# Altium project Navigation.PrjPCB
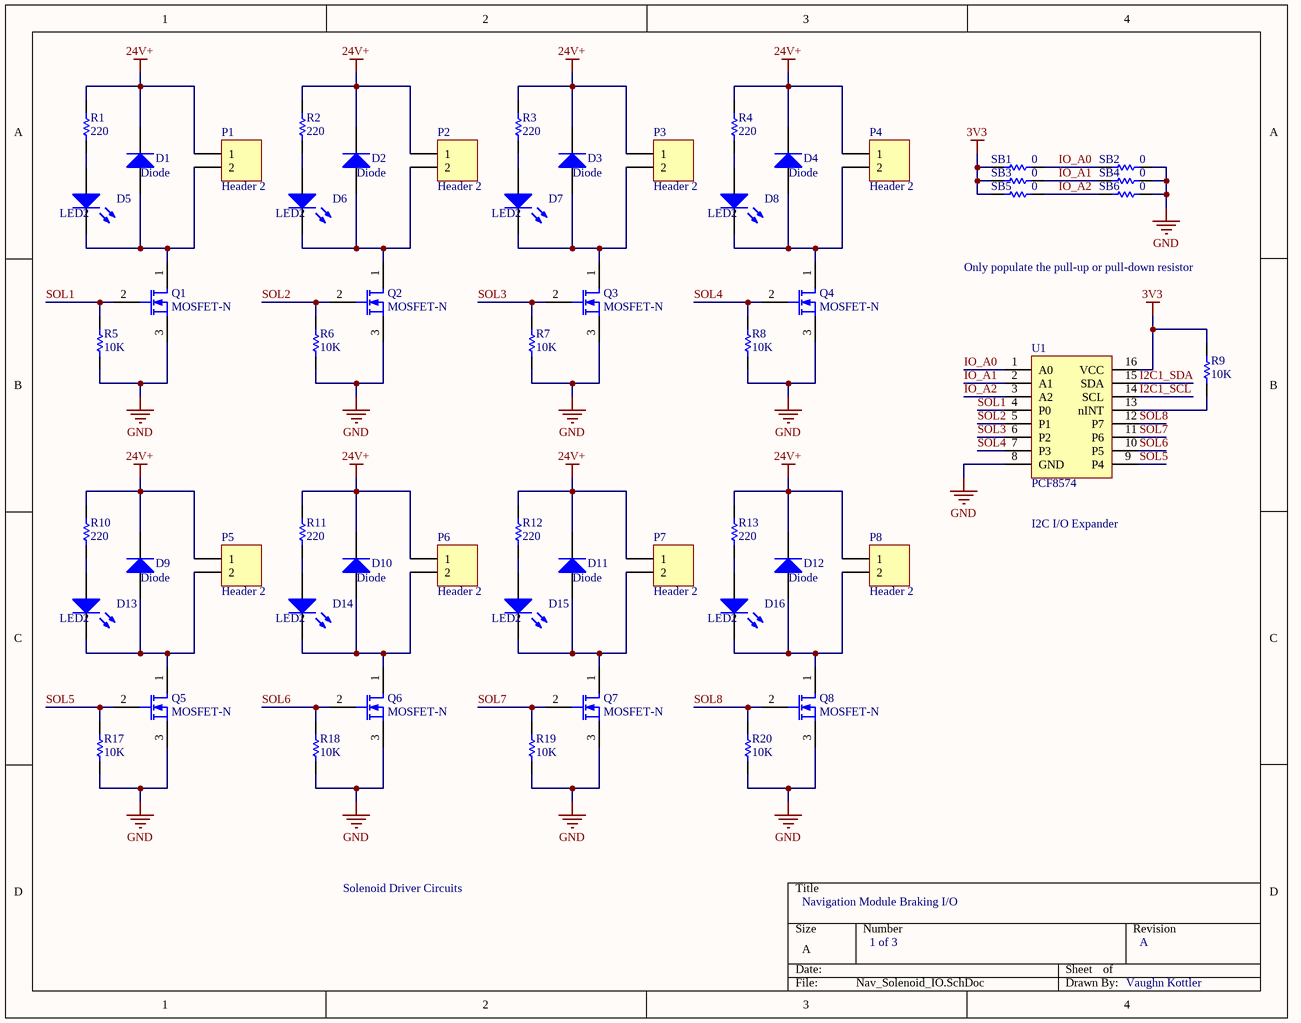
[diagram p0: Nav_Solenoid_IO.SchDoc]
3 sheets, 110 parts. Net scope: global (net labels, ports and power ports of the same name join across sheets).
Board file: Nav_PCB.PcbDoc
Sheets:
  Nav_Solenoid_IO.SchDoc
  Nav_MCU_IO.SchDoc
  Nav_Ducer_ADC.SchDoc

## Sheet Nav_Solenoid_IO.SchDoc
size A

### Parts
D1  Diode  [DIODE_SMC]
D2  Diode  [DIODE_SMC]
D3  Diode  [DIODE_SMC]
D4  Diode  [DIODE_SMC]
D5  LED2  [3.2X1.6X1.1]
D6  LED2  [3.2X1.6X1.1]
D7  LED2  [3.2X1.6X1.1]
D8  LED2  [3.2X1.6X1.1]
D9  Diode  [DIODE_SMC]
D10  Diode  [DIODE_SMC]
D11  Diode  [DIODE_SMC]
D12  Diode  [DIODE_SMC]
D13  LED2  [3.2X1.6X1.1]
D14  LED2  [3.2X1.6X1.1]
D15  LED2  [3.2X1.6X1.1]
D16  LED2  [3.2X1.6X1.1]
P1  Header 2  [2POS TERM BLOCK]
P2  Header 2  [2POS TERM BLOCK]
P3  Header 2  [2POS TERM BLOCK]
P4  Header 2  [2POS TERM BLOCK]
P5  Header 2  [2POS TERM BLOCK]
P6  Header 2  [2POS TERM BLOCK]
P7  Header 2  [2POS TERM BLOCK]
P8  Header 2  [2POS TERM BLOCK]
Q1  MOSFET-N  [SOT23_N]
Q2  MOSFET-N  [SOT23_N]
Q3  MOSFET-N  [SOT23_N]
Q4  MOSFET-N  [SOT23_N]
Q5  MOSFET-N  [SOT23_N]
Q6  MOSFET-N  [SOT23_N]
Q7  MOSFET-N  [SOT23_N]
Q8  MOSFET-N  [SOT23_N]
R1  value 220  [6-0805_M]  (hidden comment: Res1)
R2  value 220  [6-0805_M]  (hidden comment: Res1)
R3  value 220  [6-0805_M]  (hidden comment: Res1)
R4  value 220  [6-0805_M]  (hidden comment: Res1)
R5  value 10K  [6-0805_M]  (hidden comment: Res1)
R6  value 10K  [6-0805_M]  (hidden comment: Res1)
R7  value 10K  [6-0805_M]  (hidden comment: Res1)
R8  value 10K  [6-0805_M]  (hidden comment: Res1)
R9  value 10K  [6-0805_M]  (hidden comment: Res1)
R10  value 220  [6-0805_M]  (hidden comment: Res1)
R11  value 220  [6-0805_M]  (hidden comment: Res1)
R12  value 220  [6-0805_M]  (hidden comment: Res1)
R13  value 220  [6-0805_M]  (hidden comment: Res1)
R17  value 10K  [6-0805_M]  (hidden comment: Res1)
R18  value 10K  [6-0805_M]  (hidden comment: Res1)
R19  value 10K  [6-0805_M]  (hidden comment: Res1)
R20  value 10K  [6-0805_M]  (hidden comment: Res1)
SB1  value 0  [6-0805_M]  (hidden comment: Res1)
SB2  value 0  [6-0805_M]  (hidden comment: Res1)
SB3  value 0  [6-0805_M]  (hidden comment: Res1)
SB4  value 0  [6-0805_M]  (hidden comment: Res1)
SB5  value 0  [6-0805_M]  (hidden comment: Res1)
SB6  value 0  [6-0805_M]  (hidden comment: Res1)
U1  PCF8574  [16-SOIC]

### Nets
3V3: R9.2 SB1.2 SB3.2 SB5.2 U1.16(VCC)
24V+: D1.2(K) D2.2(K) D3.2(K) D4.2(K) D9.2(K) D10.2(K) D11.2(K) D12.2(K) P1.1 P2.1 P3.1 P4.1 P5.1 P6.1 P7.1 P8.1 R1.2 R2.2 R3.2 R4.2 R10.2 R11.2 R12.2 R13.2
GND: Q1.3(S) Q2.3(S) Q3.3(S) Q4.3(S) Q5.3(S) Q6.3(S) Q7.3(S) Q8.3(S) R5.1 R6.1 R7.1 R8.1 R17.1 R18.1 R19.1 R20.1 SB2.1 SB4.1 SB6.1 U1.8(GND)
I2C1_SCL: U1.14(SCL)
I2C1_SDA: U1.15(SDA)
IO_A0: SB1.1 SB2.2 U1.1(A0)
IO_A1: SB3.1 SB4.2 U1.2(A1)
IO_A2: SB5.1 SB6.2 U1.3(A2)
SOL1: Q1.2(G) R5.2 U1.4(P0)
SOL2: Q2.2(G) R6.2 U1.5(P1)
SOL3: Q3.2(G) R7.2 U1.6(P2)
SOL4: Q4.2(G) R8.2 U1.7(P3)
SOL5: Q5.2(G) R17.2 U1.9(P4)
SOL6: Q6.2(G) R18.2 U1.10(P5)
SOL7: Q7.2(G) R19.2 U1.11(P6)
SOL8: Q8.2(G) R20.2 U1.12(P7)
NetD1_1: D1.1(A) D5.2(K) P1.2 Q1.1(D)
NetD2_1: D2.1(A) D6.2(K) P2.2 Q2.1(D)
NetD3_1: D3.1(A) D7.2(K) P3.2 Q3.1(D)
NetD4_1: D4.1(A) D8.2(K) P4.2 Q4.1(D)
NetD5_1: D5.1(A) R1.1
NetD6_1: D6.1(A) R2.1
NetD7_1: D7.1(A) R3.1
NetD8_1: D8.1(A) R4.1
NetD9_1: D9.1(A) D13.2(K) P5.2 Q5.1(D)
NetD10_1: D10.1(A) D14.2(K) P6.2 Q6.1(D)
NetD11_1: D11.1(A) D15.2(K) P7.2 Q7.1(D)
NetD12_1: D12.1(A) D16.2(K) P8.2 Q8.1(D)
NetD13_1: D13.1(A) R10.1
NetD14_1: D14.1(A) R11.1
NetD15_1: D15.1(A) R12.1
NetD16_1: D16.1(A) R13.1
NetR9_1: R9.1 U1.13(nINT)

### Notes on the sheet
- Only populate the pull-up or pull-down resistor
- I2C I/O Expander
- Solenoid Driver Circuits
- Navigation Module Braking I/O
- 1 of 3
- A
- Vaughn Kottler

### Library data of the parts
D1-D4 D9-D12 = Diode: Default Diode; Published: 8-Jun-2000; LatestRevisionDate: 17-Jul-2002; LatestRevisionNote: Re-released for DXP Platform.; PackageVersion: Sep-1996; PackageReference: SMC; Publisher: Altium Limited; PackageDescription: DO-214-AB/SMC; 2 C-Bend Leads; Body 7.9 x 5.9 mm, inc. leads (LxW); Code_JEDEC: DO-214-AB
D5-D8 D13-D16 = LED2: Typical RED, GREEN, YELLOW, AMBER GaAs LED; Published: 8-Jun-2000; LatestRevisionDate: 17-Jul-2002; LatestRevisionNote: Re-released for DXP Platform.; PackageVersion: Feb-2002; PackageReference: 3.2X1.6X1.1; Publisher: Altium Limited; PackageDescription: SM LED; 2 Flat Leads
P1-P8 = Header 2: Header, 2-Pin; LatestRevisionDate: 17-Jul-2002; LatestRevisionNote: Re-released for DXP Platform.; Publisher: Altium Limited
Q1-Q8 = MOSFET-N: N-Channel MOSFET; pin to pad: 2>3 3>2; Published: 8-Jun-2000; LatestRevisionDate: 17-Jul-2002; LatestRevisionNote: Re-released for DXP Platform.; PackageVersion: 1995/1996; PackageReference: E3; Publisher: Altium Limited; PackageDescription: TO, Flat Index; 3 In-Line, Axial Leads; Body Dia. 4.6mm; Lead Dia. 0.5 mm (max)
R1-R13 R17-R20 SB1-SB6 = Res1: Resistor; Published: 8-Jun-2000; LatestRevisionDate: 17-Jul-2002; LatestRevisionNote: Re-released for DXP Platform.; PackageReference: AXIAL-0.3; Publisher: Altium Limited; PackageDescription: Axial Device, Thru-Hole; 2 Leads; 0.3 in Pin Spacing
U1 = PCF8574: I2C I/O Expander; ComponentLink1Description: Part; ComponentLink1URL: https://www.digikey.com/product-detail/en/texas-instruments/PCF8574DWR/296-13108-1-ND/484579; ComponentLink2Description: Datasheet; ComponentLink2URL: http://www.ti.com/lit/ds/symlink/pcf8574.pdf

## Sheet Nav_MCU_IO.SchDoc
size A
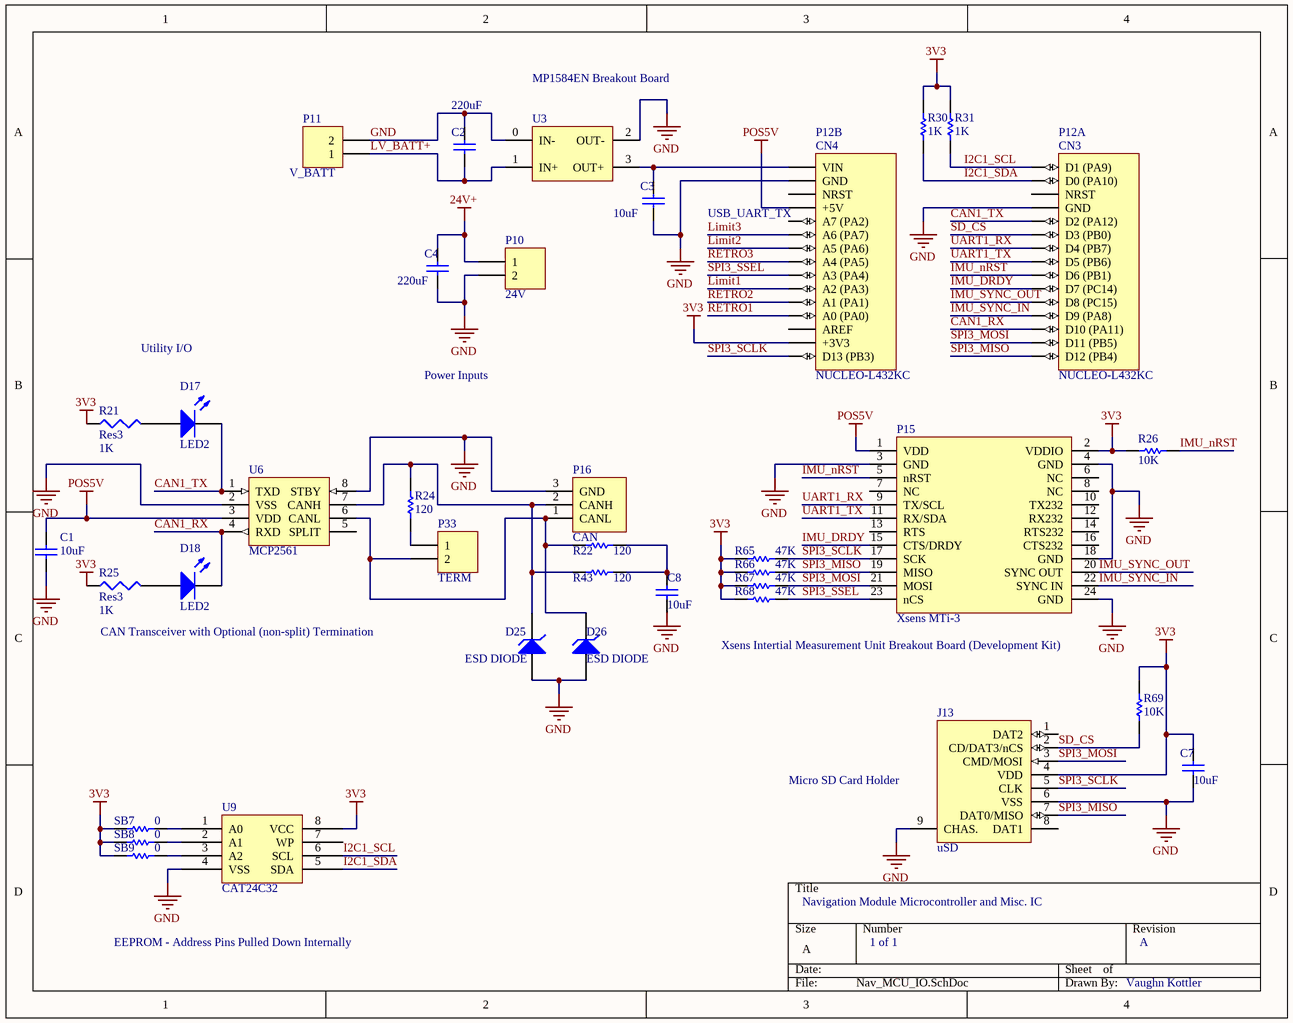
[diagram p1: Nav_MCU_IO.SchDoc]

### Parts
C1  value 10uF  [C1206]  (hidden comment: Cap)
C2  value 220uF  [CAPR5-4X5]  (hidden comment: Cap)
C3  value 10uF  [C1206]  (hidden comment: Cap)
C4  value 220uF  [CAPR5-4X5]  (hidden comment: Cap)
C7  value 10uF  [C1206]  (hidden comment: Cap)
C8  value 10uF  [C1206]  (hidden comment: Cap)
D17  LED2  [3.2X1.6X1.1]
D18  LED2  [3.2X1.6X1.1]
D25  ESD DIODE  [6-0805_M]
D26  ESD DIODE  [6-0805_M]
J13  uSD  [MICRO_SD_HOLDER]
P10  24V  [2POS TERM BLOCK]
P11  V_BATT  [2POS TERM BLOCK]
P12  NUCLEO-L432KC  [NUCLEO-32]  (parts A,B of 2)
P15  Xsens MTi-3  [Xsens]
P16  CAN  [3POS TERM BLOCK]
P33  TERM  [HDR1X2]
R21  Res3  value 1K  [J1-0603]
R22  value 120  [6-0805_M]  (hidden comment: Res1)
R24  value 120  [6-0805_M]  (hidden comment: Res1)
R25  Res3  value 1K  [J1-0603]
R26  value 10K  [6-0805_M]  (hidden comment: Res1)
R30  value 1K  [6-0805_M]  (hidden comment: Res1)
R31  value 1K  [6-0805_M]  (hidden comment: Res1)
R43  value 120  [6-0805_M]  (hidden comment: Res1)
R65  value 47K  [6-0805_M]  (hidden comment: Res1)
R66  value 47K  [6-0805_M]  (hidden comment: Res1)
R67  value 47K  [6-0805_M]  (hidden comment: Res1)
R68  value 47K  [6-0805_M]  (hidden comment: Res1)
R69  value 10K  [6-0805_M]  (hidden comment: Res1)
SB7  value 0  [6-0805_M]  (hidden comment: Res1)
SB8  value 0  [6-0805_M]  (hidden comment: Res1)
SB9  value 0  [6-0805_M]  (hidden comment: Res1)
U3  MP1584EN Breakout Board  [MP1584EN Breakout]
U6  MCP2561  [SO8_L]
U9  CAT24C32  [SO8_N]

### Nets
3V3: C7.2 J13.4(VDD) P12.17(+3V3) P15.2(VDDIO) R21.1 R25.1 R26.2 R30.2 R31.2 R65.1 R66.1 R67.1 R68.1 R69.1 SB7.2 SB8.2 SB9.2 U9.8(VCC)
24V+: C4.2 P10.1
GND: C1.1 C2.2 C3.1 C4.1 C7.1 C8.1 D25.1(A) D26.1(A) J13.6(VSS) J13.9(CHAS.) P10.2 P11.2 P12.4(GND) P12.29(GND) P15.3(GND) P15.4(GND) P15.18(GND) P15.24(GND) P16.3(GND) U3.0(IN-) U3.2(OUT-) U6.2(VSS) U6.8(STBY) U9.4(VSS)
POS5V: C1.2 P12.27(+5V) P15.1(VDD) U6.3(VDD)
CAN1_RX: D18.2(K) P12.13(D10_(PA11)) U6.4(RXD)
CAN1_TX: D17.2(K) P12.5(D2_(PA12)) U6.1(TXD)
I2C1_SCL: P12.1(D1_(PA9)) R31.1 U9.6(SCL)
I2C1_SDA: P12.2(D0_(PA10)) R30.1 U9.5(SDA)
IMU_DRDY: P12.10(D7_(PC14)) P15.15(CTS/DRDY)
IMU_nRST: P12.9(D6_(PB1)) P15.5(nRST) R26.1
IMU_SYNC_IN: P12.12(D9_(PA8)) P15.22(SYNC_IN)
IMU_SYNC_OUT: P12.11(D8_(PC15)) P15.20(SYNC_OUT)
Limit1: P12.21(A2_(PA3))
Limit2: P12.24(A5_(PA6))
Limit3: P12.25(A6_(PA7))
LV_BATT+: C2.1 P11.1 U3.1(IN+)
RETRO1: P12.19(A0_(PA0))
RETRO2: P12.20(A1_(PA1))
RETRO3: P12.23(A4_(PA5))
SD_CS: J13.2(CD/DAT3/nCS) P12.6(D3_(PB0)) R69.2
SPI3_MISO: J13.7(DAT0/MISO) P12.15(D12_(PB4)) P15.19(MISO) R66.2
SPI3_MOSI: J13.3(CMD/MOSI) P12.14(D11_(PB5)) P15.21(MOSI) R67.2
SPI3_SCLK: J13.5(CLK) P12.16(D13_(PB3)) P15.17(SCK) R65.2
SPI3_SSEL: P12.22(A3_(PA4)) P15.23(nCS) R68.2
UART1_RX: P12.7(D4_(PB7)) P15.9(TX/SCL)
UART1_TX: P12.8(D5_(PB6)) P15.11(RX/SDA)
NetC3_2: C3.2 P12.30(VIN) U3.3(OUT+)
NetC8_2: C8.2 R22.1 R43.1
NetD17_1: D17.1(A) R21.2
NetD18_1: D18.1(A) R25.2
NetD25_2: D25.2(K) P16.2(CANH) R24.2 R43.2 U6.7(CANH)
NetD26_2: D26.2(K) P16.1(CANL) P33.2 R22.2 U6.6(CANL)
NetP33_1: P33.1 R24.1
NetSB7_1: SB7.1 U9.1(A0)
NetSB8_1: SB8.1 U9.2(A1)
NetSB9_1: SB9.1 U9.3(A2)

Not connected (* = marked no-connect by the designer): J13 1(DAT2) 8(DAT1); P12 3(NRST) 18(AREF) 26(A7_(PA2)) 28(NRST); P15 6(NC) 7(NC) 8(NC) 10(TX232) 12(RX232) 13(RTS) 14(RTS232) 16(CTS232); U6 5(SPLIT); U9 7(WP)

### Notes on the sheet
- USB_UART_TX
- Utility I/O
- Power Inputs
- CAN Transceiver with Optional (non-split) Termination
- Xsens Intertial Measurement Unit Breakout Board (Development Kit)
- (near J13) Micro SD Card Holder
- Navigation Module Microcontroller and Misc. IC
- EEPROM - Address Pins Pulled Down Internally
- 1 of 1
- A
- Vaughn Kottler
- (in symbol NUCLEO-L432KC, part A) CN3
- (in symbol NUCLEO-L432KC, part B) CN4

### Library data of the parts
C1-C4 C7 C8 = Cap: Capacitor; Published: 8-Jun-2000; LatestRevisionDate: 17-Jul-2002; LatestRevisionNote: Re-released for DXP Platform.; PackageReference: RAD-0.3; Publisher: Altium Limited; PackageDescription: Radial Cap, Thru-Hole; 2 Leads; 0.3 in Pin Spacing
D17 D18 = LED2: as D5 on sheet Nav_Solenoid_IO; Published: 8-Jun-2000; LatestRevisionDate: 17-Jul-2002; LatestRevisionNote: Re-released for DXP Platform.; PackageVersion: Feb-2002; PackageReference: 3.2X1.6X1.1; Publisher: Altium Limited; PackageDescription: SM LED; 2 Flat Leads
D25 D26 = D Zener: Zener Diode; Published: 8-Jun-2000; LatestRevisionDate: 17-Jul-2002; LatestRevisionNote: Re-released for DXP Platform.; PackageReference: DIODE-0.7; Publisher: Altium Limited; PackageDescription: Diode, Thru-Hole; 2 Leads; 0.7 in Pin Spacing
J13 = SD Card
P10 P11 P33 = Header 2: Header, 2-Pin; LatestRevisionDate: 17-Jul-2002; LatestRevisionNote: Re-released for DXP Platform.; Publisher: Altium Limited
P12 = NUCLEO-L432KC: STM32L432KC Development Board; ComponentLink1Description: MBED; ComponentLink1URL: https://os.mbed.com/platforms/ST-Nucleo-L432KC/; ComponentLink2Description: Digikey; ComponentLink2URL: https://www.digikey.com/products/en?keywords=NUCLEO-L432KC
P15 = Xsens MTi-3: IMU Development Board; ComponentLink1Description: Purchase; ComponentLink1URL: https://shop-us.xsens.com/shop/mti-1-series/mti-1-series-dk/mti-3-8a7g6-dk; ComponentLink2Description: Documentation; ComponentLink2URL: https://www.xsens.com/products/mti-1-series/
R21 R25 = Res3: Resistor; Published: 8-Jun-2000; LatestRevisionDate: 29-May-2009; LatestRevisionNote: IPC-7351 Footprint Added.; PackageReference: J1-0603; Publisher: Altium Limited; PackageDescription: Chip Resistor
R22 R24 R26 R30 R31 R43 R65-R69 SB7-SB9 = Res1: Resistor; Published: 8-Jun-2000; LatestRevisionDate: 17-Jul-2002; LatestRevisionNote: Re-released for DXP Platform.; PackageReference: AXIAL-0.3; Publisher: Altium Limited; PackageDescription: Axial Device, Thru-Hole; 2 Leads; 0.3 in Pin Spacing
U3 = MP1584EN Breakout Board: Buck Converter; ComponentLink1Description: Part; ComponentLink1URL: https://www.amazon.com/eBoot-MP1584EN-Converter-Adjustable-Module/dp/B01MQGMOKI/
U6 = MCP2561: CAN Transciever; ComponentLink1Description: Part; ComponentLink1URL: https://www.digikey.com/product-detail/en/microchip-technology/MCP2561-E-SN/MCP2561-E-SN-ND/4079961; ComponentLink2Description: Datasheet; ComponentLink2URL: http://ww1.microchip.com/downloads/en/DeviceDoc/20005167C.pdf
U9 = CAT24C32: I2C EEPROM; ComponentLink1Description: Part; ComponentLink1URL: https://www.digikey.com/product-detail/en/on-semiconductor/CAT24C32WI-GT3/CAT24C32WI-GT3CT-ND/1631159; ComponentLink2Description: Datasheet; ComponentLink2URL: http://www.onsemi.com/pub/Collateral/CAT24C32-D.PDF

## Sheet Nav_Ducer_ADC.SchDoc
size A
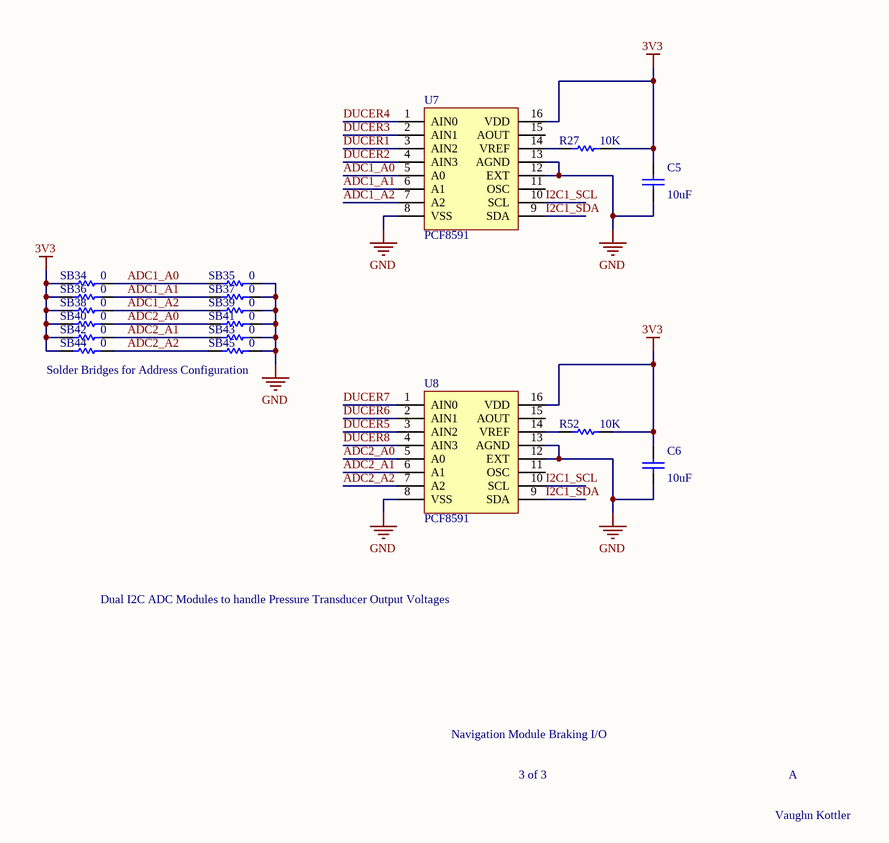
[diagram p2: Nav_Ducer_ADC.SchDoc]

### Parts
C5  value 10uF  [C1206]  (hidden comment: Cap)
C6  value 10uF  [C1206]  (hidden comment: Cap)
R27  value 10K  [6-0805_M]  (hidden comment: Res1)
R52  value 10K  [6-0805_M]  (hidden comment: Res1)
SB34  value 0  [6-0805_M]  (hidden comment: Res1)
SB35  value 0  [6-0805_M]  (hidden comment: Res1)
SB36  value 0  [6-0805_M]  (hidden comment: Res1)
SB37  value 0  [6-0805_M]  (hidden comment: Res1)
SB38  value 0  [6-0805_M]  (hidden comment: Res1)
SB39  value 0  [6-0805_M]  (hidden comment: Res1)
SB40  value 0  [6-0805_M]  (hidden comment: Res1)
SB41  value 0  [6-0805_M]  (hidden comment: Res1)
SB42  value 0  [6-0805_M]  (hidden comment: Res1)
SB43  value 0  [6-0805_M]  (hidden comment: Res1)
SB44  value 0  [6-0805_M]  (hidden comment: Res1)
SB45  value 0  [6-0805_M]  (hidden comment: Res1)
U7  PCF8591  [16-SOIC]
U8  PCF8591  [16-SOIC]

### Nets
3V3: C5.2 C6.2 R27.1 R52.1 SB34.2 SB36.2 SB38.2 SB40.2 SB42.2 SB44.2 U7.16(VDD) U8.16(VDD)
GND: C5.1 C6.1 SB35.1 SB37.1 SB39.1 SB41.1 SB43.1 SB45.1 U7.8(VSS) U7.12(EXT) U7.13(AGND) U8.8(VSS) U8.12(EXT) U8.13(AGND)
ADC1_A0: SB34.1 SB35.2 U7.5(A0)
ADC1_A1: SB36.1 SB37.2 U7.6(A1)
ADC1_A2: SB38.1 SB39.2 U7.7(A2)
ADC2_A0: SB40.1 SB41.2 U8.5(A0)
ADC2_A1: SB42.1 SB43.2 U8.6(A1)
ADC2_A2: SB44.1 SB45.2 U8.7(A2)
DUCER1: U7.3(AIN2)
DUCER2: U7.4(AIN3)
DUCER3: U7.2(AIN1)
DUCER4: U7.1(AIN0)
DUCER5: U8.3(AIN2)
DUCER6: U8.2(AIN1)
DUCER7: U8.1(AIN0)
DUCER8: U8.4(AIN3)
I2C1_SCL: U7.10(SCL) U8.10(SCL)
I2C1_SDA: U7.9(SDA) U8.9(SDA)
NetR27_2: R27.2 U7.14(VREF)
NetR52_2: R52.2 U8.14(VREF)

Not connected (* = marked no-connect by the designer): U7 11(OSC) 15(AOUT); U8 11(OSC) 15(AOUT)

### Notes on the sheet
- Solder Bridges for Address Configuration
- Dual I2C ADC Modules to handle Pressure Transducer Output Voltages
- Navigation Module Braking I/O
- 3 of 3
- A
- Vaughn Kottler

### Library data of the parts
C5 C6 = Cap: Capacitor; Published: 8-Jun-2000; LatestRevisionDate: 17-Jul-2002; LatestRevisionNote: Re-released for DXP Platform.; PackageReference: RAD-0.3; Publisher: Altium Limited; PackageDescription: Radial Cap, Thru-Hole; 2 Leads; 0.3 in Pin Spacing
R27 R52 SB34-SB45 = Res1: Resistor; Published: 8-Jun-2000; LatestRevisionDate: 17-Jul-2002; LatestRevisionNote: Re-released for DXP Platform.; PackageReference: AXIAL-0.3; Publisher: Altium Limited; PackageDescription: Axial Device, Thru-Hole; 2 Leads; 0.3 in Pin Spacing
U7 U8 = PCF8591: 8-bit A/D and D/A; ComponentLink1Description: Part; ComponentLink1URL: https://www.digikey.com/product-detail/en/nxp-usa-inc/PCF8591T-2518/568-1088-1-ND/735798; ComponentLink2Description: Datasheet; ComponentLink2URL: https://www.nxp.com/docs/en/data-sheet/PCF8591.pdf

## Nets that join several sheets
3V3: Nav_Solenoid_IO (5 pins), Nav_MCU_IO (18 pins), Nav_Ducer_ADC (12 pins)
24V+: Nav_Solenoid_IO (24 pins), Nav_MCU_IO (C4.2 P10.1)
GND: Nav_Solenoid_IO (20 pins), Nav_MCU_IO (24 pins), Nav_Ducer_ADC (14 pins)
I2C1_SCL: Nav_Solenoid_IO (U1.14), Nav_MCU_IO (P12.1 R31.1 U9.6), Nav_Ducer_ADC (U7.10 U8.10)
I2C1_SDA: Nav_Solenoid_IO (U1.15), Nav_MCU_IO (P12.2 R30.1 U9.5), Nav_Ducer_ADC (U7.9 U8.9)